# Altium schematic sheet OBC_I2C-Repeater.SchDoc: I2C Repeater
size A4; SheetNumber: 6; SheetTotal: 10
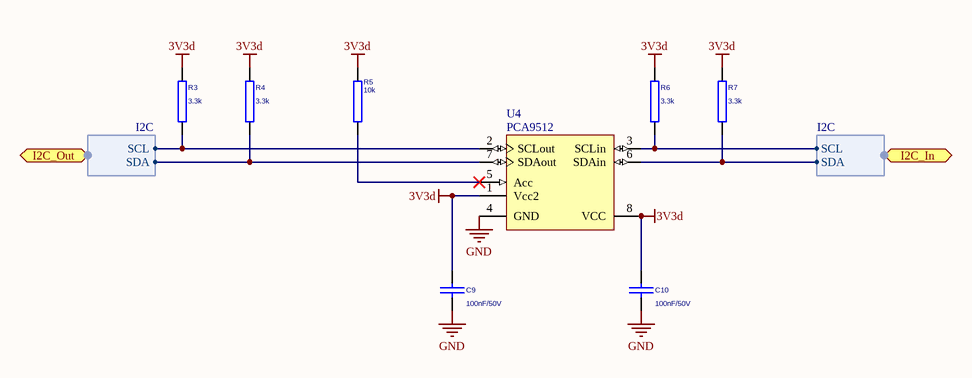
[diagram p0: OBC_I2C-Repeater.SchDoc]

## Parts
C9  100nF/50V  [C0603]
C10  100nF/50V  [C0603]
R3  3.3k  [R0603]
R4  3.3k  [R0603]
R5  10k  [R0603]
R6  3.3k  [R0603]
R7  3.3k  [R0603]
U4  PCA9512  [TSSOP8]

## Ports
I2C_In (harness I2C), I2C_Out (harness I2C)

## Harnesses
I2C: SDA, SCL

## Nets
3V3d: C9.1 C10.1 R3.1 R4.1 R5.2 R6.1 R7.1 U4.1(Vcc2) U4.8(VCC)
GND: C9.2 C10.2 U4.4(GND)
NetR3_2: R3.2 U4.2(SCLout) ; port I2C_Out.SCL
NetR4_2: R4.2 U4.7(SDAout) ; port I2C_Out.SDA
NetR5_1: R5.1 U4.5(Acc)
NetR6_2: R6.2 U4.3(SCLin) ; port I2C_In.SCL
NetR7_2: R7.2 U4.6(SDAin) ; port I2C_In.SDA

## Notes on the sheet
- Title:
- Project:
- Author:
- Model:
- Document Number:
- Checked by:
- Rev:
- Date:
- Approved by:
- Sheet:
- of
- File name:

## Library data of the parts
C9 C10 = CAP: Capacitator; Voltage: 50V; Material: X7R; Value: 100nF; Farnell: 1759122; Supplier Part Number 1: 1759122; Supplier 1: Farnell
R3-R7 = RES: Resistor; Tolerance: 1%; Supplier 1: Farnell
  R3 R4 R6 R7: Farnell: 2446676; Value: 3.3k; Supplier Part Number 1: 2446676
  R5: Farnell: 2446547; Value: 10k; Supplier Part Number 1: 2446547
U4 = PCA9512: Level shifting hot swappable  I  2C and SMBus buffer; Manufacturer: Texas Instruments; partNo: PCA9512DP; Supplier 1: Digi-Key; DigiKey: 568-1907-1-ND